# Altium schematic sheet 35.SchDoc
size 513 x 386 mm
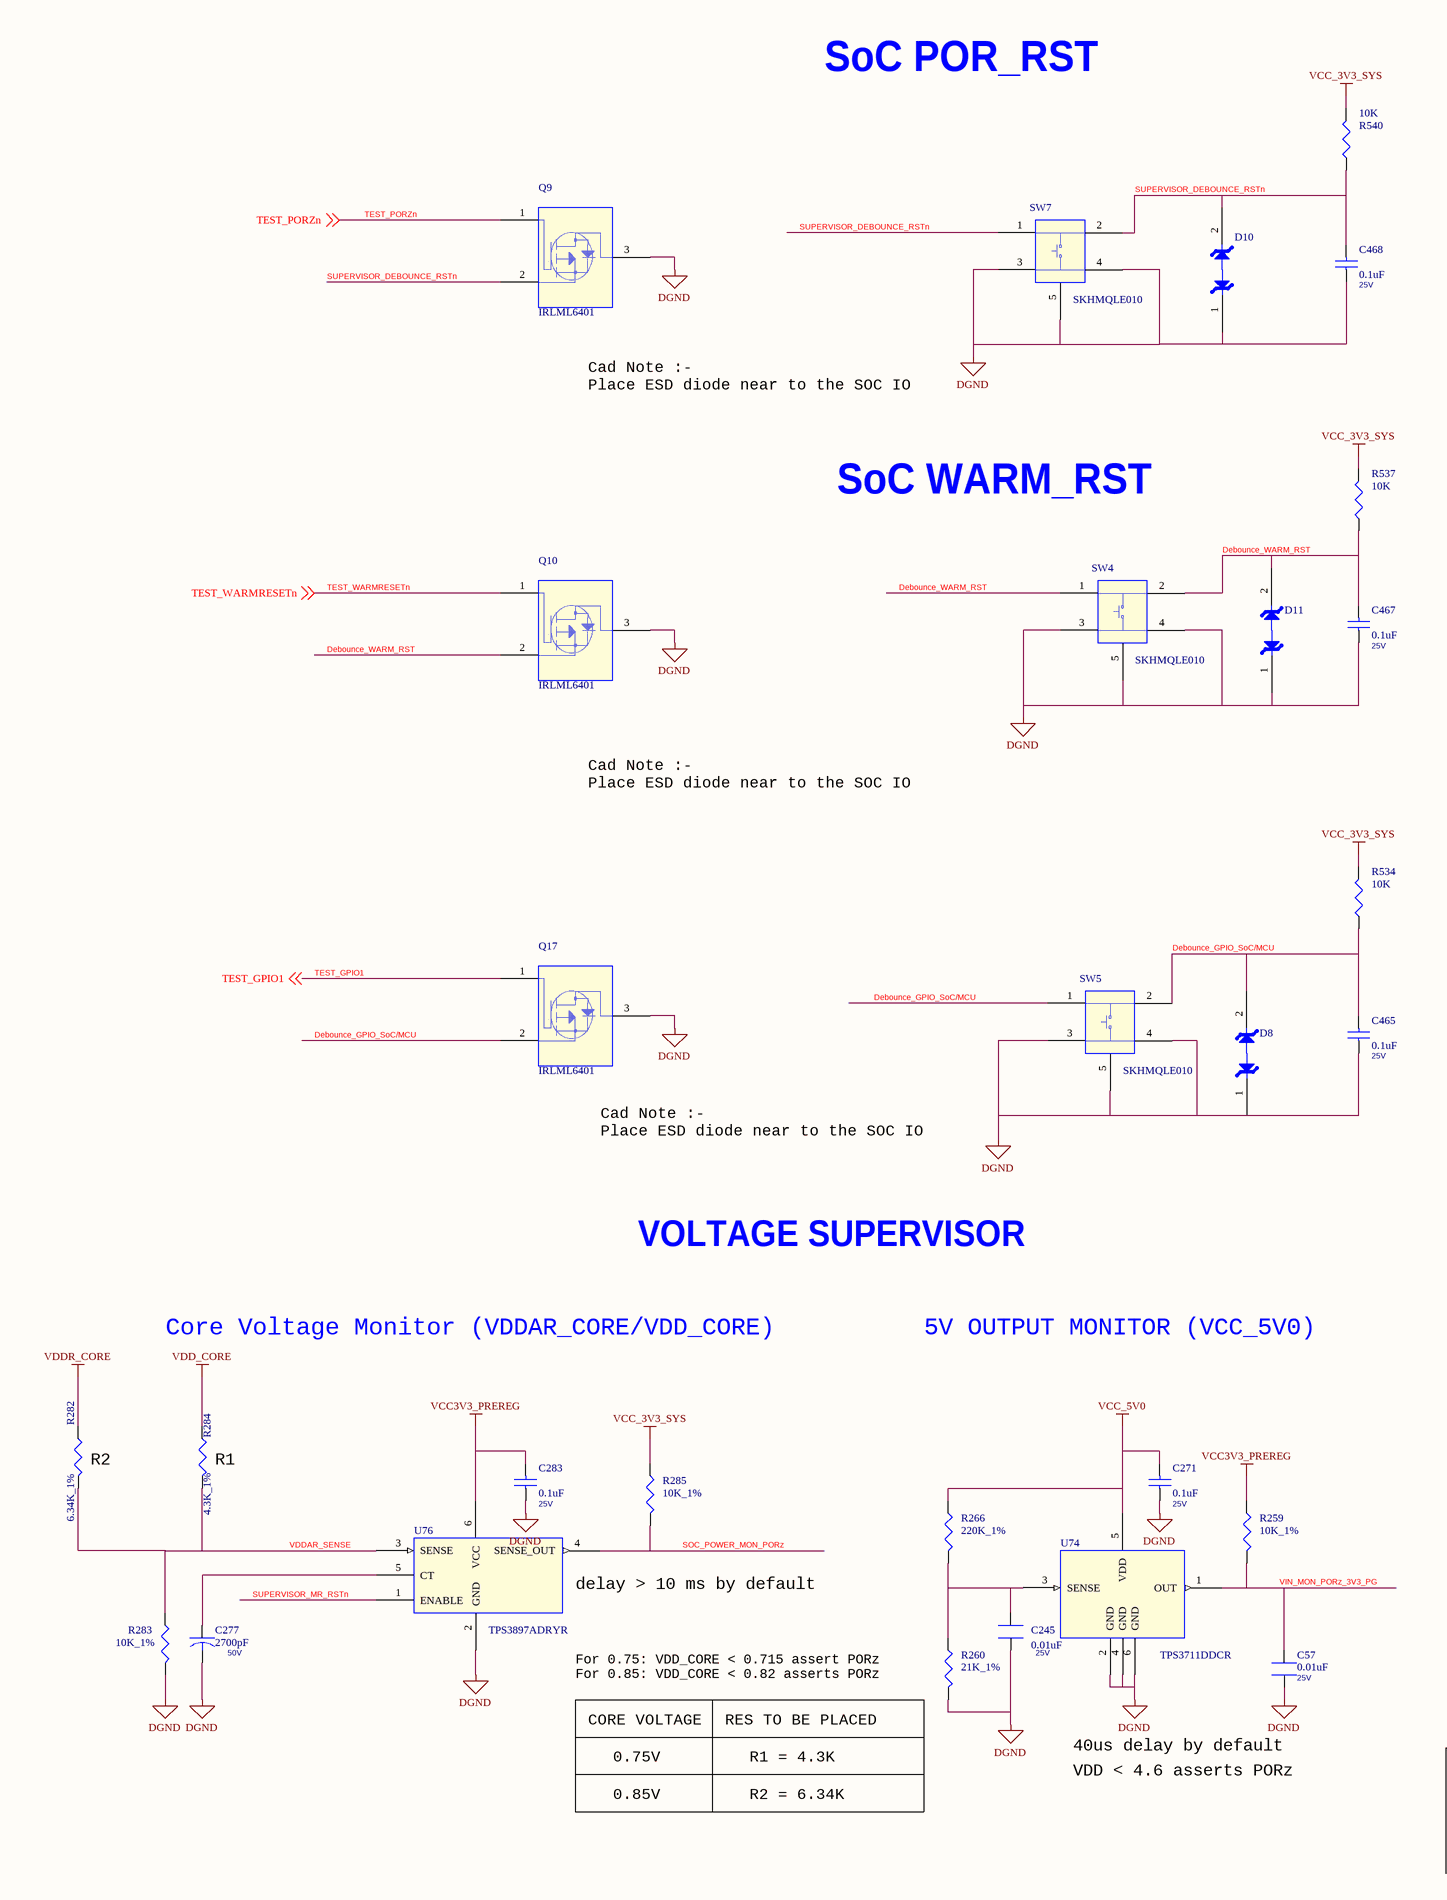
[diagram p0: 35.SchDoc, left]
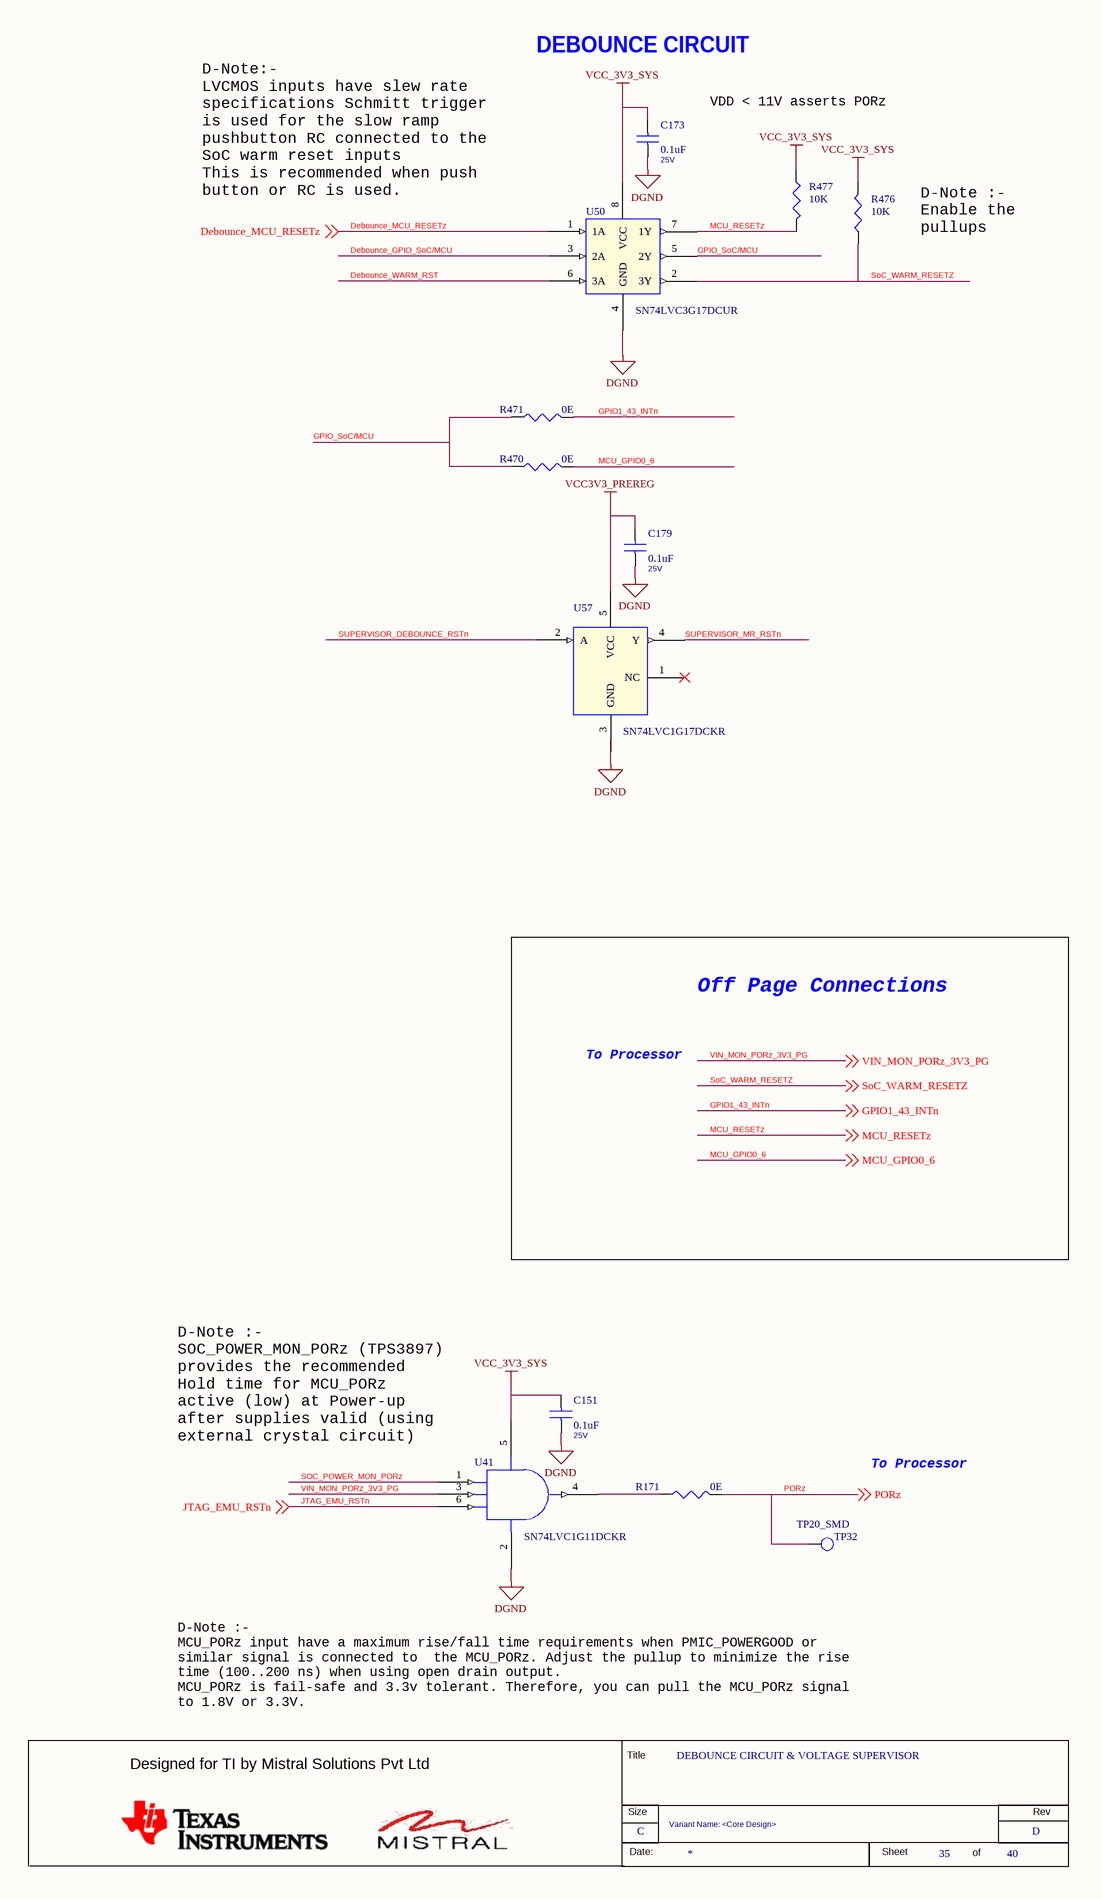
[diagram p1: 35.SchDoc, right]

## Parts
*  RevCode: D  Title: DEBOUNCE CIRCUIT & VOLTAGE SUPERVISOR  Page Size: C  Page Number: 35  Page Count: 40  Variant Name: <Core Design>  (hidden comment: MISTRAL_TITLEBLK_CSIZE)  (graphical)
C57  0.01uF  Voltage: 25V  [CAP0402N]
C151  0.1uF  Voltage: 25V  [CAP0402_0-75]
C173  0.1uF  Voltage: 25V  [CAP0402_0-75]
C179  0.1uF  Voltage: 25V  [CAP0402_0-75]
C245  0.01uF  Voltage: 25V  [CAP0402N]
C271  0.1uF  Voltage: 25V  [CAP0402_0-75]
C277  2700pF  Voltage: 50V  [CAP0603_1]
C283  0.1uF  Voltage: 25V  [CAP0402_0-75]
C465  0.1uF  Voltage: 25V  [CAP0402_0-75]
C467  0.1uF  Voltage: 25V  [CAP0402_0-75]
C468  0.1uF  Voltage: 25V  [CAP0402_0-75]
D8  TPD1E10B06DPYR  [DIO_DFN0402_0-5]  (value not drawn)
D10  TPD1E10B06DPYR  [DIO_DFN0402_0-5]  (value not drawn)
D11  TPD1E10B06DPYR  [DIO_DFN0402_0-5]  (value not drawn)
Q9  IRLML6401  [TO_SOT23-123]
Q10  IRLML6401  [TO_SOT23-123]
Q17  IRLML6401  [TO_SOT23-123]
R171  0E  [RES0402_0-5]
R259  10K_1%  [RES0402_0-5]
R260  21K_1%  [RES0402_0-5]
R266  220K_1%  [RES0402_0-5]
R282  6.34K_1%  [RES0402_0-5]
R283  10K_1%  [RES0402_0-5]
R284  4.3K_1%  [RES0402_0-5]
R285  10K_1%  [RES0402_0-5]
R470  0E  [RES0402_0-5]
R471  0E  [RES0402_0-5]
R476  10K  [RES0402_0-5]
R477  10K  [RES0402_0-5]
R534  10K  [RES0402_0-5]
R537  10K  [RES0402_0-5]
R540  10K  [RES0402_0-5]
SW4  SKHMQLE010  [SW4_SKHMQLE010_240X260_SMD_3-1]
SW5  SKHMQLE010  [SW4_SKHMQLE010_240X260_SMD_3-1]
SW7  SKHMQLE010  [SW4_SKHMQLE010_240X260_SMD_3-1]
TP32  TP20_SMD  [TP20_SMD]
U41  SN74LVC1G11DCKR  [SC70-6]
U50  SN74LVC3G17DCUR  [VSSOP8_19-68_85X95_0-9]
U57  SN74LVC1G17DCKR  [SC70-5]
U74  TPS3711DDCR  [SOT23-6_1-1]
U76  TPS3897ADRYR  [SON6_19-68_40X60_0-6]

## Nets
DGND: C57.2 C151.1 C173.1 C179.1 C245.2 C271.1 C277.2 C283.1 C465.1 C467.1 C468.1 D8.1 D10.1 D11.1 Q9.3(D) Q10.3(D) Q17.3(D) R260.2 R283.2 SW4.3 SW4.4 SW4.5(GND) SW5.3 SW5.4 SW5.5(GND) SW7.3 SW7.4 SW7.5(GND) U41.2(GND) U50.4(GND) U57.3(GND) U74.2(GND) U74.4(GND) U74.6(GND) U76.2(GND)
VCC3V3_PREREG: C179.2 C283.2 R259.1 U57.5(VCC) U76.6(VCC)
VCC_3V3_SYS: C151.2 C173.2 R285.1 R476.2 R477.1 R534.2 R537.2 R540.2 U41.5(VCC) U50.8(VCC)
VCC_5V0: C271.2 R266.1 U74.5(VDD)
VDD_CORE: R284.1
VDDR_CORE: R282.1
Debounce_GPIO_SoC/MCU: C465.2 D8.2 Q17.2(S) R534.1 SW5.1 SW5.2 U50.3(2A)
Debounce_MCU_RESETz: U50.1(1A) ; off-sheet Debounce_MCU_RESETz
Debounce_WARM_RST: C467.2 D11.2 Q10.2(S) R537.1 SW4.1 SW4.2 U50.6(3A)
GPIO1_43_INTn: R471.2 ; off-sheet GPIO1_43_INTn
GPIO_SoC/MCU: R470.1 R471.1 U50.5(2Y)
JTAG_EMU_RSTn: U41.6(C) ; off-sheet JTAG_EMU_RSTn
MCU_GPIO0_6: R470.2 ; off-sheet MCU_GPIO0_6
MCU_RESETz: R477.2 U50.7(1Y) ; off-sheet MCU_RESETz
PORz: R171.2 TP32.1(TP) ; off-sheet PORz
SOC_POWER_MON_PORz: R285.2 U41.1(A) U76.4(SENSE_OUT)
SoC_WARM_RESETZ: R476.1 U50.2(3Y) ; off-sheet SoC_WARM_RESETZ
SUPERVISOR_DEBOUNCE_RSTn: C468.2 D10.2 Q9.2(S) R540.1 SW7.1 SW7.2 U57.2(A)
SUPERVISOR_MR_RSTn: U57.4(Y) U76.1(ENABLE)
TEST_GPIO1: Q17.1(G) ; off-sheet TEST_GPIO1
TEST_PORZn: Q9.1(G) ; off-sheet TEST_PORZn
TEST_WARMRESETn: Q10.1(G) ; off-sheet TEST_WARMRESETn
VDDAR_SENSE: R282.2 R283.1 R284.2 U76.3(SENSE)
VIN_MON_PORz_3V3_PG: C57.1 R259.2 U41.3(B) U74.1(OUT) ; off-sheet VIN_MON_PORz_3V3_PG
NetC245_1: C245.1 R260.1 R266.2 U74.3(SENSE)
NetC277_1: C277.1 U76.5(CT)
NetR171_1: R171.1 U41.4(Y)

Not connected (* = marked no-connect by the designer): U57 1(NC)*

## Notes on the sheet
- SoC POR_RST
- D-Note:-
  LVCMOS inputs have slew rate
  specifications Schmitt trigger
  is used for the slow ramp
  pushbutton RC connected to the
  SoC warm reset inputs
  This is recommended when push
  button or RC is used.
- DEBOUNCE CIRCUIT
- VDD < 11V asserts PORz
- D-Note :-
  Enable the
  pullups
- Cad Note :-
  Place ESD diode near to the SOC IO
- SoC WARM_RST
- Off Page Connections
- To Processor
- VOLTAGE SUPERVISOR
- Core Voltage Monitor (VDDAR_CORE/VDD_CORE)
- 5V OUTPUT MONITOR (VCC_5V0)
- (near U41) D-Note :-
  SOC_POWER_MON_PORz (TPS3897)
  provides the recommended
  Hold time for MCU_PORz
  active (low) at Power-up
  after supplies valid (using
  external crystal circuit)
- (near R282) R2
- (near R284) R1
- (near U76) delay > 10 ms by default
- For 0.75: VDD_CORE < 0.715 assert PORz
  For 0.85: VDD_CORE < 0.82 asserts PORz
- D-Note :-
  MCU_PORz input have a maximum rise/fall time requirements when PMIC_POWERGOOD or
  similar signal is connected to  the MCU_PORz. Adjust the pullup to minimize the rise
  time (100..200 ns) when using open drain output.
  MCU_PORz is fail-safe and 3.3v tolerant. Therefore, you can pull the MCU_PORz signal
  to 1.8V or 3.3V.
- CORE VOLTAGE
- RES TO BE PLACED
- 0.75V
- R1 = 4.3K
- 40us delay by default
- VDD < 4.6 asserts PORz
- 0.85V
- R2 = 6.34K
- (in symbol MISTRAL_TITLEBLK_CSIZE) Title; Designed for TI by Mistral Solutions Pvt Ltd; Size; Rev; Date:; Sheet; of

## Library data of the parts
* = MISTRAL_TITLEBLK_CSIZE: Issue: 1.0; Page Create Date: March  8, 1995; Page Modify Date: *
C57 C245 = CAP_Dup2: CAP CERAMIC 0.01uF 25V 10% X7R 0402; Mistral Part No: 120011090040-R; Mfr_name: WURTH ELECTRONICS; Mfr_part_number: 885012205050; Part_type: CAPACITORS\CERAMIC; Project: AM64x_EVM_BRD; Customs_HS_Code: 85322990; Custom_Duty: 15%; Wattage: NA; MECHANICAL 3D STEP FILE: CAP0402_0-75; Library Ref: CAP; Tolerance: 10%; Package: 0402; Distributor_name: DIGIKEY; Distributor_part_number: 732-7545-1-ND; Height: 0.55MM; Datasheet: Y:\MIS_DATABASE\DATASHEETS\CAPACITORS\885012205050.PDF; Crtd /date: ALVY/170820; Chkd/date: MANIRAJA/170820; Weight: 0.65mg; Temperature: -55癈+125癈; Footprint Ref: CAP0402_0-75; Library Path: Y:\MIS_DATABASE\Library\ALTIUM_TOOL\SCHEMATICS_PARTS\MS_DISCRETE_Library.schlib; Footprint Path: Y:\MIS_DATABASE\Library\ALTIUM_TOOL\PCB_FOOTPRINTS\Altium_Footprint_Lib.PcbLib; PCB Footprint: CAP0402_0-75
C151 C173 C179 C271 C283 C467 C468 = CAP_Dup3: CAP CERAMIC 0.1uF 25V 20% X5R 0402; Alt_Mfr_name: YAGEO AMERICA; Part_type: CAPACITORS\CERAMIC; Mfr_part_number: 885012105018; Mfr_name: WURTH ELECTRONICS; Mistral Part No: 120020080003-R; Alt_Mfr_part_number: CC0402KRX5R8BB104; Custom_Duty: 15%; Customs_HS_Code: 85322990; Wattage: NA; Project: AM64x_EVM_BRD; Footprint Path: Y:\MIS_DATABASE\Library\ALTIUM_TOOL\PCB_FOOTPRINTS\Altium_Footprint_Lib.PcbLib; Library Path: Y:\MIS_DATABASE\Library\ALTIUM_TOOL\SCHEMATICS_PARTS\MS_DISCRETE_Library.schlib; Footprint Ref: CAP0402_0-75; Library Ref: CAP; MECHANICAL 3D STEP FILE: CAP0402_0-75; Chkd/date: MANIRAJA/170820; Crtd /date: ALVY/170820; Datasheet: Y:\MIS_DATABASE\DATASHEETS\CAPACITORS\885012105018.PDF; Temperature: -55癈+85癈; Weight: 0.65mg; Height: 0.55MM; Distributor_part_number: 732-7495-1-ND; Distributor_name: DIGIKEY; Package: 0402; Tolerance: 20%; PCB Footprint: CAP0402_0-75
C277 = CAP_Dup1: CAP CERAMIC 2700pF 50V 5% C0G(NP0) 0603; Part_type: CAPACITORS\CERAMIC; Mfr_part_number: GRM1885C1H272JA01D; Mfr_name: MURATA; Mistral Part No: 120011090002-R; Custom_Duty: 15%; Customs_HS_Code: 85322990; Wattage: NA; Project: GEMYC; Footprint Path: Y:\MIS_DATABASE\Library\ALTIUM_TOOL\PCB_FOOTPRINTS\Altium_Footprint_Lib.PcbLib; Library Path: Y:\MIS_DATABASE\Library\ALTIUM_TOOL\SCHEMATICS_PARTS\MS_DISCRETE_Library.schlib; MECHANICAL 3D STEP FILE: CAP0603_1; Chkd/date: BAVISH/050911; Crtd /date: CHAITHANYA/290811; Datasheet: Y:\MIS_DATABASE\DATASHEETS\CAPACITORS\MURATA-GXX-SER_NOV17.PDF; Temperature: -55癈+125癈; Weight: 6.3mg; Height: 0.90MM; Library Ref: CAP; Distributor_part_number: 490-3283-1-ND; Distributor_name: DIGIKEY; Package: 0603; Tolerance: 5%; Footprint Ref: CAP0603_1; PCB Footprint: CAP0603_1
C465 = CAP_Dup3: CAP CERAMIC 0.1uF 25V 20% X5R 0402; Alt_Mfr_part_number: CC0402KRX5R8BB104; Mistral Part No: 120020080003-R; Mfr_name: WURTH ELECTRONICS; Mfr_part_number: 885012105018; Part_type: CAPACITORS\CERAMIC; Alt_Mfr_name: YAGEO AMERICA; Project: AM64x_EVM_BRD; Wattage: NA; Customs_HS_Code: 85322990; Custom_Duty: 15%; Tolerance: 20%; Package: 0402; Distributor_name: DIGIKEY; Distributor_part_number: 732-7495-1-ND; Height: 0.55MM; Weight: 0.65mg; Temperature: -55癈+85癈; Datasheet: Y:\MIS_DATABASE\DATASHEETS\CAPACITORS\885012105018.PDF; Crtd /date: ALVY/170820; Chkd/date: MANIRAJA/170820; MECHANICAL 3D STEP FILE: CAP0402_0-75; Library Ref: CAP; Footprint Ref: CAP0402_0-75; Library Path: Y:\MIS_DATABASE\Library\ALTIUM_TOOL\SCHEMATICS_PARTS\MS_DISCRETE_Library.schlib; Footprint Path: Y:\MIS_DATABASE\Library\ALTIUM_TOOL\PCB_FOOTPRINTS\Altium_Footprint_Lib.PcbLib; PCB Footprint: CAP0402_0-75
D8 D10 = DIODE_SOD323: DIODE 1CH ESD PROTECTION X1SON2; Mistral Part No: 130014110022-R; Mfr_name: TEXAS INSTRUMENTS; Project: GALILEO_EVM; Tolerance: NA; Customs_HS_Code: 85423100; Custom_Duty: 15%; Footprint Ref: DIO_DFN0402_0-5; Mfr_part_number: TPD1E10B06DPYR; Part_type: DIODE; Voltage: NA; Wattage: NA; Package: X1SON2; Distributor_name: DIGIKEY; Distributor_part_number: 296-30406-1-ND; Library Ref: DIODE_SOD323; Height: 0.45MM; Weight: 1mg; Temperature: -40癈+125癈; Datasheet: Y:\MIS_DATABASE\DATASHEETS\ICS\INTERFACE\TPD1E10B06-SER.PDF; Crtd /date: VASANTHA/181114; Chkd/date: MANIRAJA/040420; MECHANICAL 3D STEP FILE: DIO_DFN0402_0-5; Library Path: Y:\MIS_DATABASE\Library\ALTIUM_TOOL\SCHEMATICS_PARTS\MS_DISCRETE_Library.schlib; Footprint Path: Y:\MIS_DATABASE\Library\ALTIUM_TOOL\PCB_FOOTPRINTS\Altium_Footprint_Lib.PcbLib; PCB Footprint: DIO_DFN0402_0-5
D11 = DIODE_SOD323: DIODE 1CH ESD PROTECTION X1SON2; Mfr_name: TEXAS INSTRUMENTS; Mistral Part No: 130014110022-R; Custom_Duty: 15%; Customs_HS_Code: 85423100; Wattage: NA; Project: GALILEO_EVM; Footprint Path: Y:\MIS_DATABASE\Library\ALTIUM_TOOL\PCB_FOOTPRINTS\Altium_Footprint_Lib.PcbLib; Library Path: Y:\MIS_DATABASE\Library\ALTIUM_TOOL\SCHEMATICS_PARTS\MS_DISCRETE_Library.schlib; MECHANICAL 3D STEP FILE: DIO_DFN0402_0-5; Chkd/date: MANIRAJA/040420; Crtd /date: VASANTHA/181114; Datasheet: Y:\MIS_DATABASE\DATASHEETS\ICS\INTERFACE\TPD1E10B06-SER.PDF; Temperature: -40癈+125癈; Weight: 1mg; Height: 0.45MM; Library Ref: DIODE_SOD323; Distributor_part_number: 296-30406-1-ND; Distributor_name: DIGIKEY; Package: X1SON2; Voltage: NA; Tolerance: NA; Part_type: DIODE; Mfr_part_number: TPD1E10B06DPYR; Footprint Ref: DIO_DFN0402_0-5; PCB Footprint: DIO_DFN0402_0-5
Q9 Q17 = MOSFET_IRLML6401TR: TRANSISTOR MOSFET P-CHANNEL SOT23-3; Part_type: TRANSISTOR\MOSFET; Mfr_part_number: IRLML6401TRPBF; Mfr_name: IRF; Mistral Part No: 130009031213-P; Custom_Duty: 15%; Customs_HS_Code: 85412900; Wattage: NA; Project: G4_SVGA; Library Ref: MOSFET_IRLML6401TR; RoHS: Pb-Free; Chkd/date: SHREESHAIL/020206; Crtd /date: MAZHAR/040505; Datasheet: Y:\MIS_DATABASE\DATASHEETS\DISCRETES\TRANSISTORS_FETS\IRLML6401.PDF; Temperature: -55癈+150癈; Weight: NA; Height: 1.11MM; Distributor_part_number: IRLML6401PBFCT-ND; Distributor_name: DIGIKEY; Package: SOT23-3; Voltage: NA; Tolerance: NA; PCB Footprint: TO_SOT23-123
Q10 = MOSFET_IRLML6401TR: TRANSISTOR MOSFET P-CHANNEL SOT23-3; Mistral Part No: 130009031213-P; Mfr_name: IRF; Mfr_part_number: IRLML6401TRPBF; Part_type: TRANSISTOR\MOSFET; Project: G4_SVGA; Tolerance: NA; Customs_HS_Code: 85412900; Custom_Duty: 15%; Voltage: NA; Wattage: NA; Package: SOT23-3; Distributor_name: DIGIKEY; Distributor_part_number: IRLML6401PBFCT-ND; Height: 1.11MM; Weight: NA; Temperature: -55癈+150癈; Datasheet: Y:\MIS_DATABASE\DATASHEETS\DISCRETES\TRANSISTORS_FETS\IRLML6401.PDF; Crtd /date: MAZHAR/040505; Chkd/date: SHREESHAIL/020206; RoHS: Pb-Free; Library Ref: MOSFET_IRLML6401TR; PCB Footprint: TO_SOT23-123
R171 = RESISTOR_Dup6: RES 0E 1/16W JUMPER 0402; Part_type: RESISTORS\FIXED; Mfr_part_number: CRCW04020000Z0ED; Mfr_name: VISHAY; Mistral Part No: 110010080019-R; Custom_Duty: 15%; Customs_HS_Code: 85332119; Voltage: NA; Project: PB_BUGBASE; Footprint Path: Y:\MIS_DATABASE\Library\ALTIUM_TOOL\PCB_FOOTPRINTS\Altium_Footprint_Lib.PcbLib; Library Path: Y:\MIS_DATABASE\Library\ALTIUM_TOOL\SCHEMATICS_PARTS\MS_DISCRETE_Library.schlib; Footprint Ref: RES0402_0-5; Library Ref: RESISTOR; MECHANICAL 3D STEP FILE: RES0402_0-5; Chkd/date: VASANTHA/201216; Crtd /date: MUDDU/190810; Datasheet: Y:\MIS_DATABASE\DATASHEETS\RESISTORS\CRCW0603.PDF; Temperature: -55癈+155癈; Weight: 0.65mg; Height: 0.40MM; Distributor_part_number: 541-0.0JCT-ND; Distributor_name: DIGIKEY; Package: 0402; Wattage: 1/16W; Tolerance: NA; PCB Footprint: RES0402_0-5
R259 R283 R285 = RESISTOR_Dup5: RES 10K 1/16W 1% 0402; Part_type: RESISTORS\FIXED; Mfr_part_number: RC0402FR-0710KL; Mfr_name: YAGEO AMERICA; Mistral Part No: 110015090015-R; Custom_Duty: 15%; Customs_HS_Code: 85332119; Project: VOCERA; Voltage: NA; PCB Footprint: RES0402_0-5; Footprint Path: Y:\MIS_DATABASE\Library\ALTIUM_TOOL\PCB_FOOTPRINTS\Altium_Footprint_Lib.PcbLib; Library Path: Y:\MIS_DATABASE\Library\ALTIUM_TOOL\SCHEMATICS_PARTS\MS_DISCRETE_Library.schlib; Footprint Ref: RES0402_0-5; Library Ref: RESISTOR; Chkd/date: VASANTHA/201216; Crtd /date: GEETHA/290506; Datasheet: Y:\MIS_DATABASE\DATASHEETS\RESISTORS\RCXXXXL-SER_MAR18.PDF; Height: 0.40MM; Distributor_part_number: 311-10.0KLRTR-ND; Distributor_name: DIGIKEY; Package: 0402; Wattage: 1/16W; Tolerance: 1%; Weight: 0.65mg; Temperature: -55癈+155癈; MECHANICAL 3D STEP FILE: RES0402_0-5
R260 = RESISTOR_Dup6: RES 21K 1/16W 1% 0402; Mistral Part No: 110015080019-R; Mfr_name: YAGEO AMERICA; Mfr_part_number: RC0402FR-0721KL; Part_type: RESISTORS\FIXED; Project: OCTASIC_3000; Voltage: NA; Customs_HS_Code: 85332119; Custom_Duty: 15%; PCB Footprint: RES0402_0-5; Footprint Ref: RES0402_0-5; Tolerance: 1%; Wattage: 1/16W; Package: 0402; Distributor_name: DIGIKEY; Distributor_part_number: 311-21.0KLRCT-ND; Library Ref: RESISTOR; Height: 0.40MM; Weight: 0.65mg; Temperature: -55癈+155癈; Datasheet: Y:\MIS_DATABASE\DATASHEETS\RESISTORS\RCXXXXL-SER_MAR18.PDF; Crtd /date: MANIRAJA/200319; Chkd/date: MANIRAJA/200319; MECHANICAL 3D STEP FILE: RES0402_0-5; Library Path: Y:\MIS_DATABASE\Library\ALTIUM_TOOL\SCHEMATICS_PARTS\MS_DISCRETE_Library.schlib; Footprint Path: Y:\MIS_DATABASE\Library\ALTIUM_TOOL\PCB_FOOTPRINTS\Altium_Footprint_Lib.PcbLib
R266 = RESISTOR_Dup6: RES 220K 1/16W 1% 0402; Mistral Part No: 110017080025-R; Mfr_name: VISHAY; Mfr_part_number: CRCW0402220KFKED; Part_type: RESISTORS\FIXED; Project: TI_MAXIE_CPB; Voltage: NA; Customs_HS_Code: 85332119; Custom_Duty: 15%; PCB Footprint: RES0402_0-5; Footprint Path: Y:\MIS_DATABASE\Library\ALTIUM_TOOL\PCB_FOOTPRINTS\Altium_Footprint_Lib.PcbLib; Library Path: Y:\MIS_DATABASE\Library\ALTIUM_TOOL\SCHEMATICS_PARTS\MS_DISCRETE_Library.schlib; Footprint Ref: RES0402_0-5; Library Ref: RESISTOR; Tolerance: 1%; Wattage: 1/16W; Package: 0402; Distributor_name: DIGIKEY; Distributor_part_number: 541-220KLCT-ND; Height: 0.40MM; Weight: 0.65mg; Temperature: -55癈+155癈; Datasheet: Y:\MIS_DATABASE\DATASHEETS\RESISTORS\CRCW0603.PDF; Crtd /date: MANIRAJA/230817; Chkd/date: MANIRAJA/230817; MECHANICAL 3D STEP FILE: RES0402_0-5
R282 = RESISTOR: RES 6.34K 1/16W 1% 0402; Mistral Part No: 110009031024-R; Mfr_name: YAGEO AMERICA; Mfr_part_number: RT0402FRE076K34; Part_type: RESISTORS\FIXED; Project: V8TS; Voltage: NA; Customs_HS_Code: 85332119; Custom_Duty: 15%; PCB Footprint: RES0402_0-5; Footprint Ref: RES0402_0-5; Tolerance: 1%; Wattage: 1/16W; Package: 0402; Distributor_name: DIGIKEY; Distributor_part_number: RT0402FRE076K34L-ND; Library Ref: RESISTOR; Height: 0.35MM; Weight: 0.65mg; Temperature: -55癈+155癈; Datasheet: Y:\MIS_DATABASE\DATASHEETS\RESISTORS\YAGEO_RT-SERIES.PDF; Crtd /date: SHREESHAIL/310707; Chkd/date: VASANTHA/281216; MECHANICAL 3D STEP FILE: RES0402_0-5; Library Path: Y:\MIS_DATABASE\Library\ALTIUM_TOOL\SCHEMATICS_PARTS\MS_DISCRETE_Library.schlib; Footprint Path: Y:\MIS_DATABASE\Library\ALTIUM_TOOL\PCB_FOOTPRINTS\Altium_Footprint_Lib.PcbLib
R284 = RESISTOR_Dup6: RES 4.3K 1/16W 1% 0402; Part_type: RESISTORS\FIXED; Mfr_part_number: RC0402FR-074K3L; Mfr_name: YAGEO AMERICA; Mistral Part No: 110016060004-R; Custom_Duty: 15%; Customs_HS_Code: 85332119; Voltage: NA; Project: TMDXCSKCC; PCB Footprint: RES0402_0-5; Footprint Path: Y:\MIS_DATABASE\Library\ALTIUM_TOOL\PCB_FOOTPRINTS\Altium_Footprint_Lib.PcbLib; Library Path: Y:\MIS_DATABASE\Library\ALTIUM_TOOL\SCHEMATICS_PARTS\MS_DISCRETE_Library.schlib; MECHANICAL 3D STEP FILE: RES0402_0-5; Chkd/date: VASANTHA/140616; Crtd /date: VASANTHA/140616; Datasheet: Y:\MIS_DATABASE\DATASHEETS\RESISTORS\RCXXXXL-SER_MAR18.PDF; Temperature: -55癈+155癈; Weight: 0.65mg; Height: 0.40MM; Library Ref: RESISTOR; Distributor_part_number: 311-4.30KLRCT-ND; Distributor_name: DIGIKEY; Package: 0402; Wattage: 1/16W; Tolerance: 1%; Footprint Ref: RES0402_0-5
R470 R471 = RESISTOR_Dup5: RES 0E 1/16W JUMPER 0402; Mistral Part No: 110010080019-R; Mfr_name: VISHAY; Mfr_part_number: CRCW04020000Z0ED; Part_type: RESISTORS\FIXED; Project: PB_BUGBASE; Tolerance: NA; Customs_HS_Code: 85332119; Custom_Duty: 15%; Footprint Path: Y:\MIS_DATABASE\Library\ALTIUM_TOOL\PCB_FOOTPRINTS\Altium_Footprint_Lib.PcbLib; Library Path: Y:\MIS_DATABASE\Library\ALTIUM_TOOL\SCHEMATICS_PARTS\MS_DISCRETE_Library.schlib; Footprint Ref: RES0402_0-5; Library Ref: RESISTOR; Voltage: NA; Wattage: 1/16W; Package: 0402; Distributor_name: DIGIKEY; Distributor_part_number: 541-0.0JCT-ND; Height: 0.40MM; Weight: 0.65mg; Temperature: -55癈+155癈; Datasheet: Y:\MIS_DATABASE\DATASHEETS\RESISTORS\CRCW0603.PDF; Crtd /date: MUDDU/190810; Chkd/date: VASANTHA/201216; MECHANICAL 3D STEP FILE: RES0402_0-5; PCB Footprint: RES0402_0-5
R476 R477 R534 R540 = RESISTOR_Dup6: RES 10K 1/16W 5% 0402; Mistral Part No: 110011060021-R; Mfr_name: YAGEO AMERICA; Mfr_part_number: RC0402JR-0710KL; Part_type: RESISTORS\FIXED; Project: HSE; Voltage: NA; Customs_HS_Code: 85332119; Custom_Duty: 15%; PCB Footprint: RES0402_0-5; Tolerance: 5%; Wattage: 1/16W; Package: 0402; Distributor_name: DIGIKEY; Distributor_part_number: 311-10KJRCT-ND; Height: 0.40MM; Weight: 0.65mg; Temperature: -55癈+155癈; Datasheet: Y:\MIS_DATABASE\DATASHEETS\RESISTORS\RCXXXXL-SER_MAR18.PDF; Crtd /date: MAZHAR/230805; Chkd/date: VASANTHA/061216; MECHANICAL 3D STEP FILE: RES0402_0-5; Library Ref: RESISTOR; Footprint Ref: RES0402_0-5; Library Path: Y:\MIS_DATABASE\Library\ALTIUM_TOOL\SCHEMATICS_PARTS\MS_DISCRETE_Library.schlib; Footprint Path: Y:\MIS_DATABASE\Library\ALTIUM_TOOL\PCB_FOOTPRINTS\Altium_Footprint_Lib.PcbLib
R537 = RESISTOR_Dup6: RES 10K 1/16W 5% 0402; Part_type: RESISTORS\FIXED; Mfr_part_number: RC0402JR-0710KL; Mfr_name: YAGEO AMERICA; Mistral Part No: 110011060021-R; Custom_Duty: 15%; Customs_HS_Code: 85332119; Voltage: NA; Project: HSE; Footprint Path: Y:\MIS_DATABASE\Library\ALTIUM_TOOL\PCB_FOOTPRINTS\Altium_Footprint_Lib.PcbLib; Library Path: Y:\MIS_DATABASE\Library\ALTIUM_TOOL\SCHEMATICS_PARTS\MS_DISCRETE_Library.schlib; Footprint Ref: RES0402_0-5; Library Ref: RESISTOR; MECHANICAL 3D STEP FILE: RES0402_0-5; Chkd/date: VASANTHA/061216; Crtd /date: MAZHAR/230805; Datasheet: Y:\MIS_DATABASE\DATASHEETS\RESISTORS\RCXXXXL-SER_MAR18.PDF; Temperature: -55癈+155癈; Weight: 0.65mg; Height: 0.40MM; Distributor_part_number: 311-10KJRCT-ND; Distributor_name: DIGIKEY; Package: 0402; Wattage: 1/16W; Tolerance: 5%; PCB Footprint: RES0402_0-5
SW4 = SW4_SKHUPLE010: SWITCH TACTILE SPST ST SMD; Part_type: ELECTRO-MECHANICAL\SWITCH; Mfr_name: ALPS; Mistral Part No: 130017100007-R; Custom_Duty: 24%; Customs_HS_Code: 85369090; Wattage: NA; Project: TI_MAXIE_CPB; Library Ref: SW4_SKHUPLE010; MECHANICAL 3D STEP FILE: SW4_SKHMQLE010_240X260_SMD_3-1; Chkd/date: MANIRAJA/051017; Crtd /date: MANIRAJA/051017; Datasheet: Y:\MIS_DATABASE\DATASHEETS\MISC\SWITCHES\SKHMQLE010.PDF; Temperature: -30癈+85癈; Weight: NA; Height: 3.10MM; Distributor_part_number: 688-SKHMQLE010; Distributor_name: MOUSER; Package: SMD; Voltage: NA; Tolerance: NA; Mfr_part_number: SKHMQLE010; PCB Footprint: SW4_SKHMQLE010_240X260_SMD_3-1
SW5 SW7 = SW4_SKHUPLE010: SWITCH TACTILE SPST ST SMD; Mistral Part No: 130017100007-R; Mfr_name: ALPS; Part_type: ELECTRO-MECHANICAL\SWITCH; Project: TI_MAXIE_CPB; Tolerance: NA; Customs_HS_Code: 85369090; Custom_Duty: 24%; Mfr_part_number: SKHMQLE010; Voltage: NA; Wattage: NA; Package: SMD; Distributor_name: MOUSER; Distributor_part_number: 688-SKHMQLE010; Height: 3.10MM; Weight: NA; Temperature: -30癈+85癈; Datasheet: Y:\MIS_DATABASE\DATASHEETS\MISC\SWITCHES\SKHMQLE010.PDF; Crtd /date: MANIRAJA/051017; Chkd/date: MANIRAJA/051017; MECHANICAL 3D STEP FILE: SW4_SKHMQLE010_240X260_SMD_3-1; Library Ref: SW4_SKHUPLE010; PCB Footprint: SW4_SKHMQLE010_240X260_SMD_3-1
TP32 = TESTPOINT: TESTPOINT CIR 20 SMD; Mfr_name: LOCAL; Custom_Duty: NA; Project: BT MODULE_CSRBC04; Customs_HS_Code: NA; RoHS: NA; Footprint Ref: TP20_SMD; Library Ref: TESTPOINT; Chkd/date: SHREESHAIL/171006; Crtd /date: MAZHAR/171006; Height: NA; Distributor_part_number: NA; Distributor_name: NA; Package: SMD; Part_type: TESTPOINT; Mfr_part_number: TP20_SMD; Mistral Part No: NA; Tolerance: NA; Voltage: NA; Wattage: NA; Weight: NA; Temperature: NA; Datasheet: NA; MECHANICAL 3D STEP FILE: NA; Library Path: Y:\MIS_DATABASE\Library\ALTIUM_TOOL\SCHEMATICS_PARTS\MS_DISCRETE_Library.schlib; Footprint Path: Y:\MIS_DATABASE\Library\ALTIUM_TOOL\PCB_FOOTPRINTS\Altium_Footprint_Lib.PcbLib; PCB Footprint: TP20_SMD
U41 = SN74LVC1G11DCKR_SC70-6: IC SINGLE 3-INPUT POSITIVE-AND GATE SC70-6; Part_type: ICS\DIGITAL\GATES; Mfr_name: TEXAS INSTRUMENTS; Mistral Part No: 141009030230-R; Custom_Duty: 15%; Customs_HS_Code: 85423100; Project: VOCERA; RoHS: Sb/ Br FREE; Chkd/date: SHREESHAIL/220506; Crtd /date: MAZHAR/150506; Datasheet: Y:\MIS_DATABASE\DATASHEETS\ICS\DIGITAL\GATES\SN74LVC1G.PDF; Height: 1.10MM; Distributor_part_number: 296-18066-1-ND; Distributor_name: DIGIKEY; Package: SC70-6; Mfr_part_number: SN74LVC1G11DCKR; Library Ref: SN74LVC1G11DCKR_SC70-6; PCB Footprint: SC70-6
U50 = SN74LVC3G17DCUR_VSSOP8: IC TRIPLE SCHMITT-TRIGGER BUFFER VSSOP8; Mistral Part No: 141017090019-R; Mfr_name: TEXAS INSTRUMENTS; Part_type: ICS\DIGITAL\COMBINATIONAL; Project: TI_MAXIE_CPB; Tolerance: NA; Customs_HS_Code: 85423100; Custom_Duty: 15%; PCB Footprint: VSSOP8_19-68_85X95_0-9; Library Ref: SN74LVC3G17DCUR_VSSOP8; Mfr_part_number: SN74LVC3G17DCUR; Voltage: NA; Wattage: NA; Package: VSSOP8; Distributor_name: DIGIKEY; Distributor_part_number: 296-18818-1-ND; Height: 0.90MM; Weight: 9.6mg; Temperature: -40癈+125癈; Datasheet: Y:\MIS_DATABASE\DATASHEETS\ICS\DIGITAL\COMBINATIONAL\SN74LVC3G17.PDF; Crtd /date: MANIRAJA/280917; Chkd/date: MANIRAJA/280917; MECHANICAL 3D STEP FILE: VSSOP8_19-68_85X95_0-9
U57 = SN74LVC1G17DCKR_SC70-5: IC SINGLE SCHMITT-TRIGGER BUFFER SC70-5; Mistral Part No: 141010110012-R; Mfr_name: TEXAS INSTRUMENTS; Part_type: ICS\DIGITAL\COMBINATIONAL; Project: ITS-PWR_CARD; Tolerance: NA; Customs_HS_Code: 85423100; Custom_Duty: 15%; PCB Footprint: SC70-5; Mfr_part_number: SN74LVC1G17DCKR; Voltage: NA; Wattage: NA; Package: SC70-5; Distributor_name: DIGIKEY; Distributor_part_number: 296-11934-1-ND; Library Ref: SN74LVC1G17DCKR_SC70-5; Height: 1.10MM; Weight: NA; Temperature: -40癈+85癈; Datasheet: Y:\MIS_DATABASE\DATASHEETS\ICS\DIGITAL\COMBINATIONAL\SN74LVC1G17DCK.PDF; Crtd /date: BAVISH/251110; Chkd/date: MAZHAR/011210
U74 = TPS3711DDCR_SOT23-6: IC 36V VOLTAGE DETECTOR SOT23-6; Part_type: ICS\POWER\MANAGEMENT; Mfr_name: TEXAS INSTRUMENTS; Mistral Part No: 142017100008-R; Custom_Duty: 15%; Customs_HS_Code: 85423100; Wattage: NA; Project: TI_MAXIE_CPB; PCB Footprint: SOT23-6_1-1; Library Ref: TPS3711DDCR_SOT23-6; MECHANICAL 3D STEP FILE: SOT23-6_1-1; Chkd/date: MANIRAJA/091017; Crtd /date: MANIRAJA/091017; Datasheet: Y:\MIS_DATABASE\DATASHEETS\ICS\POWER\TPS3711D.PDF; Temperature: -40癈+125癈; Weight: 30mg; Height: 1.10MM; Distributor_part_number: 296-43278-1-ND; Distributor_name: DIGIKEY; Package: SOT23-6; Voltage: NA; Tolerance: NA; Mfr_part_number: TPS3711DDCR
U76 = TPS3897ADRYR_SON6: IC 1-CH ADJ VOLTAGE MONITOR SON6; Part_type: ICS\POWER\MANAGEMENT; Mfr_name: TEXAS INSTRUMENTS; Mistral Part No: 142017100007-R; Custom_Duty: 15%; Customs_HS_Code: 85423100; Wattage: NA; Project: TI_MAXIE_CPB; PCB Footprint: SON6_19-68_40X60_0-6; MECHANICAL 3D STEP FILE: SON6_19-68_40X60_0-6; Chkd/date: MANIRAJA/091017; Crtd /date: MANIRAJA/091017; Datasheet: Y:\MIS_DATABASE\DATASHEETS\ICS\POWER\TPS389X.PDF; Temperature: -40癈+125癈; Weight: NA; Height: 0.60MM; Distributor_part_number: 296-29810-1-ND; Distributor_name: DIGIKEY; Package: SON6; Voltage: NA; Tolerance: NA; Mfr_part_number: TPS3897ADRYR; Library Ref: TPS3897ADRYR_SON6